# EAGLE design Controller (EAGLE 7.2.0)
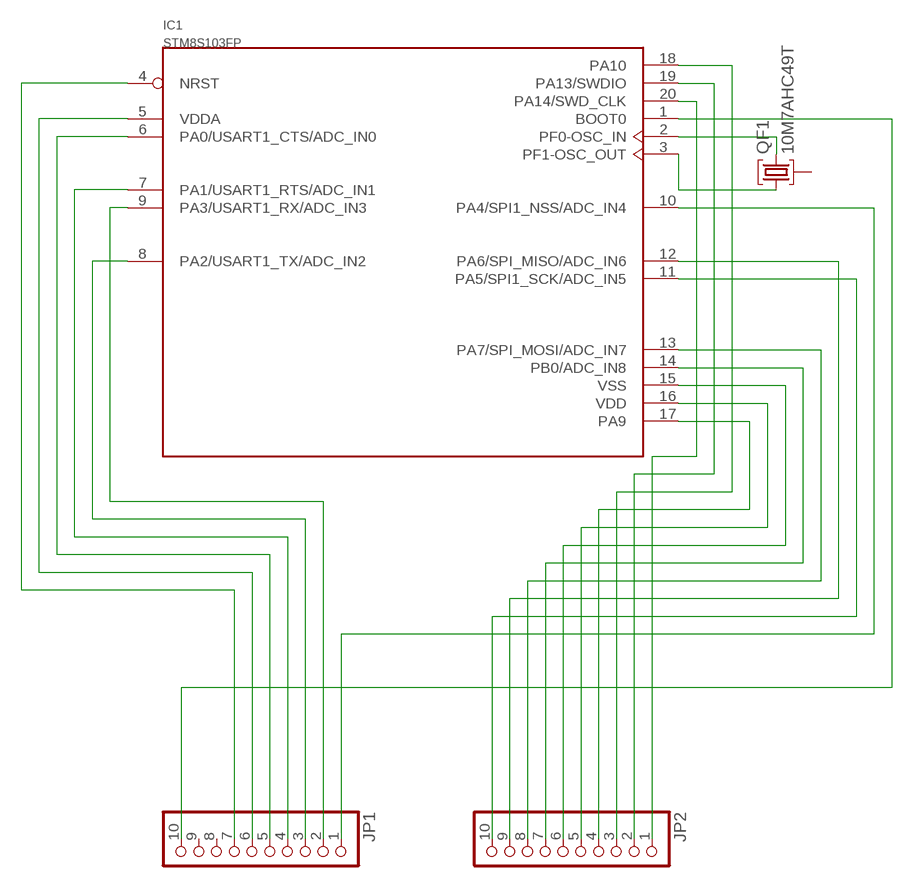
[diagram p0: schematic, sheet 1]

## Parts
IC1  STM8S103FP  [TSSOP20]
JP1  PINHD-1X10  [1X10]
JP2  PINHD-1X10  [1X10]
QF1  10M7AHC49T  [HC49U]

## Nets
N$1: IC1.1(BOOT0) JP1.10
N$2: IC1.2(PF0-OSC_IN) QF1.3
N$3: IC1.3(PF1-OSC_OUT) QF1.1
N$4: IC1.4(NRST) JP1.7
N$5: IC1.5(VDDA) JP1.6
N$6: IC1.6(PA0/USART1_CTS/ADC_IN0) JP1.5
N$7: IC1.7(PA1/USART1_RTS/ADC_IN1) JP1.4
N$8: IC1.8(PA2/USART1_TX/ADC_IN2) JP1.3
N$9: IC1.9(PA3/USART1_RX/ADC_IN3) JP1.2
N$10: IC1.10(PA4/SPI1_NSS/ADC_IN4) JP1.1
N$11: IC1.11(PA5/SPI1_SCK/ADC_IN5) JP2.10
N$12: IC1.12(PA6/SPI_MISO/ADC_IN6) JP2.9
N$13: IC1.13(PA7/SPI_MOSI/ADC_IN7) JP2.8
N$14: IC1.14(PB0/ADC_IN8) JP2.7
N$15: IC1.15(VSS) JP2.6
N$16: IC1.16(VDD) JP2.5
N$17: IC1.17(PA9) JP2.4
N$18: IC1.18(PA10) JP2.3
N$19: IC1.19(PA13/SWDIO) JP2.2
N$20: IC1.20(PA14/SWD_CLK) JP2.1
Unconnected: JP1.8 JP1.9 QF1.2

## Library data of the parts
IC1 = stm8s103:STM8S103F*: STM8S103F*
JP1 JP2 = pinhead:PINHD-1X10: PIN HEADER
QF1 = crystal:10M*A: Monolithic Crystal Filters Source: www.vanlong.com; OC_FARNELL: unknown; OC_NEWARK: unknown

## Board
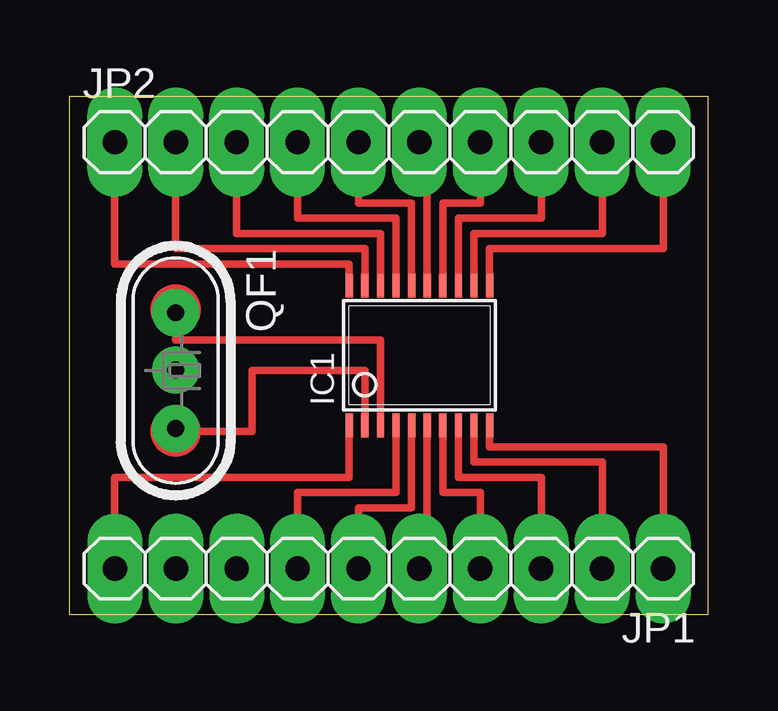
[diagram p1: board, top side]

Size 26.65 x 21.59 mm. Coordinates in mm from the lower left corner, seen from the top.
Outline: 0,0 26.65,0 26.65,21.59 0,21.59 0,0
Copper layers (1*16): Top 0.035mm / dielectric 1.5mm / Bottom 0.035mm
Design rules "default *": minimum track width 10mil, minimum drill 8mil, track to track 8mil, track to pad 8mil, pad to pad 8mil, via to via 8mil, smd to smd 8mil, copper to edge 40mil, drill to drill 8mil, minimum pad ring 25mil, minimum via ring 8mil, stop-mask expansion 4mil, vias tented up to drill 0mil, thermal gap 10mil

### Footprints (pad centres in the part's own frame; a part is rotated, then mirrored left to right if it is on the bottom)
TSSOP20 = smd 0.305 x 0.991: 1 -2.925,-2.918; 2 -2.275,-2.918; 3 -1.625,-2.918; 4 -0.975,-2.918; 5 -0.325,-2.918; 6 0.325,-2.918; 7 0.975,-2.918; 8 1.625,-2.918; 9 2.275,-2.918; 10 2.925,-2.918; 11 2.925,2.918; 12 2.275,2.918; 13 1.625,2.918; 14 0.975,2.918; 15 0.325,2.918; 16 -0.325,2.918; 17 -0.975,2.918; 18 -1.625,2.918; 19 -2.275,2.918; 20 -2.925,2.918
1X10 = drill 1.016 long: 1 -11.43,0; 2 -8.89,0; 3 -6.35,0; 4 -3.81,0; 5 -1.27,0; 6 1.27,0; 7 3.81,0; 8 6.35,0; 9 8.89,0; 10 11.43,0
HC49U = drill 0.7 pad 1.2: 1 -2.413,0; 2 -0.027,0; 3 2.413,0

### Placement (x,y rotation side)
IC1  14.61,10.79 0 top
JP1  13.34,1.91 180 top
JP2  13.34,19.68 0 top
QF1  4.45,10.16 270 top

### Tracks (layer width: path | path; a pad name or v marks a point on that pad's centre or on a via)
N$1
  Top 0.305: IC1.1 11.68,5.71 1.91,5.71 JP1.10
N$2
  Top 0.305: IC1.2 12.33,10.16 7.62,10.16 7.62,7.62 5.08,7.62 5.08,7.75 QF1.3
N$3
  Top 0.305: IC1.3 12.98,11.43 4.45,11.43 QF1.1
N$4
  Top 0.305: IC1.4 13.63,5.08 9.53,5.08 JP1.7
N$5
  Top 0.305: IC1.5 14.28,4.45 12.06,4.45 JP1.6
N$6
  Top 0.305: IC1.6 14.93,1.91 JP1.5
N$7
  Top 0.305: IC1.7 15.58,5.08 17.14,5.08 JP1.4
N$8
  Top 0.305: IC1.8 16.23,5.71 19.68,5.71 JP1.3
N$9
  Top 0.305: IC1.9 16.88,6.35 22.23,6.35 JP1.2
N$10
  Top 0.305: IC1.10 17.53,6.99 24.77,6.99 JP1.1
N$11
  Top 0.305: IC1.11 17.53,15.24 24.77,15.24 JP2.10
N$12
  Top 0.305: IC1.12 16.88,15.88 22.23,15.88 JP2.9
N$13
  Top 0.305: IC1.13 16.23,16.51 19.68,16.51 JP2.8
N$14
  Top 0.305: IC1.14 15.58,17.14 17.14,17.14 JP2.7
N$15
  Top 0.305: IC1.15 14.93,19.68 JP2.6
N$16
  Top 0.305: IC1.16 14.28,17.14 12.06,17.14 JP2.5
N$17
  Top 0.305: IC1.17 13.63,16.51 9.53,16.51 JP2.4
N$18
  Top 0.305: IC1.18 12.98,15.88 6.99,15.88 JP2.3
N$19
  Top 0.305: IC1.19 12.33,15.24 4.45,15.24 JP2.2
N$20
  Top 0.305: IC1.20 11.68,14.61 1.91,14.61 JP2.1
(copper drawn outside any net)
  shapes: Top circle x2